# Altium schematic sheet GeneralScheme.SchDoc: Машинка на радиоуправлении
size 420 x 297 mm; Author: Веричев Е. О.; SheetNumber: 1; SheetTotal: 1
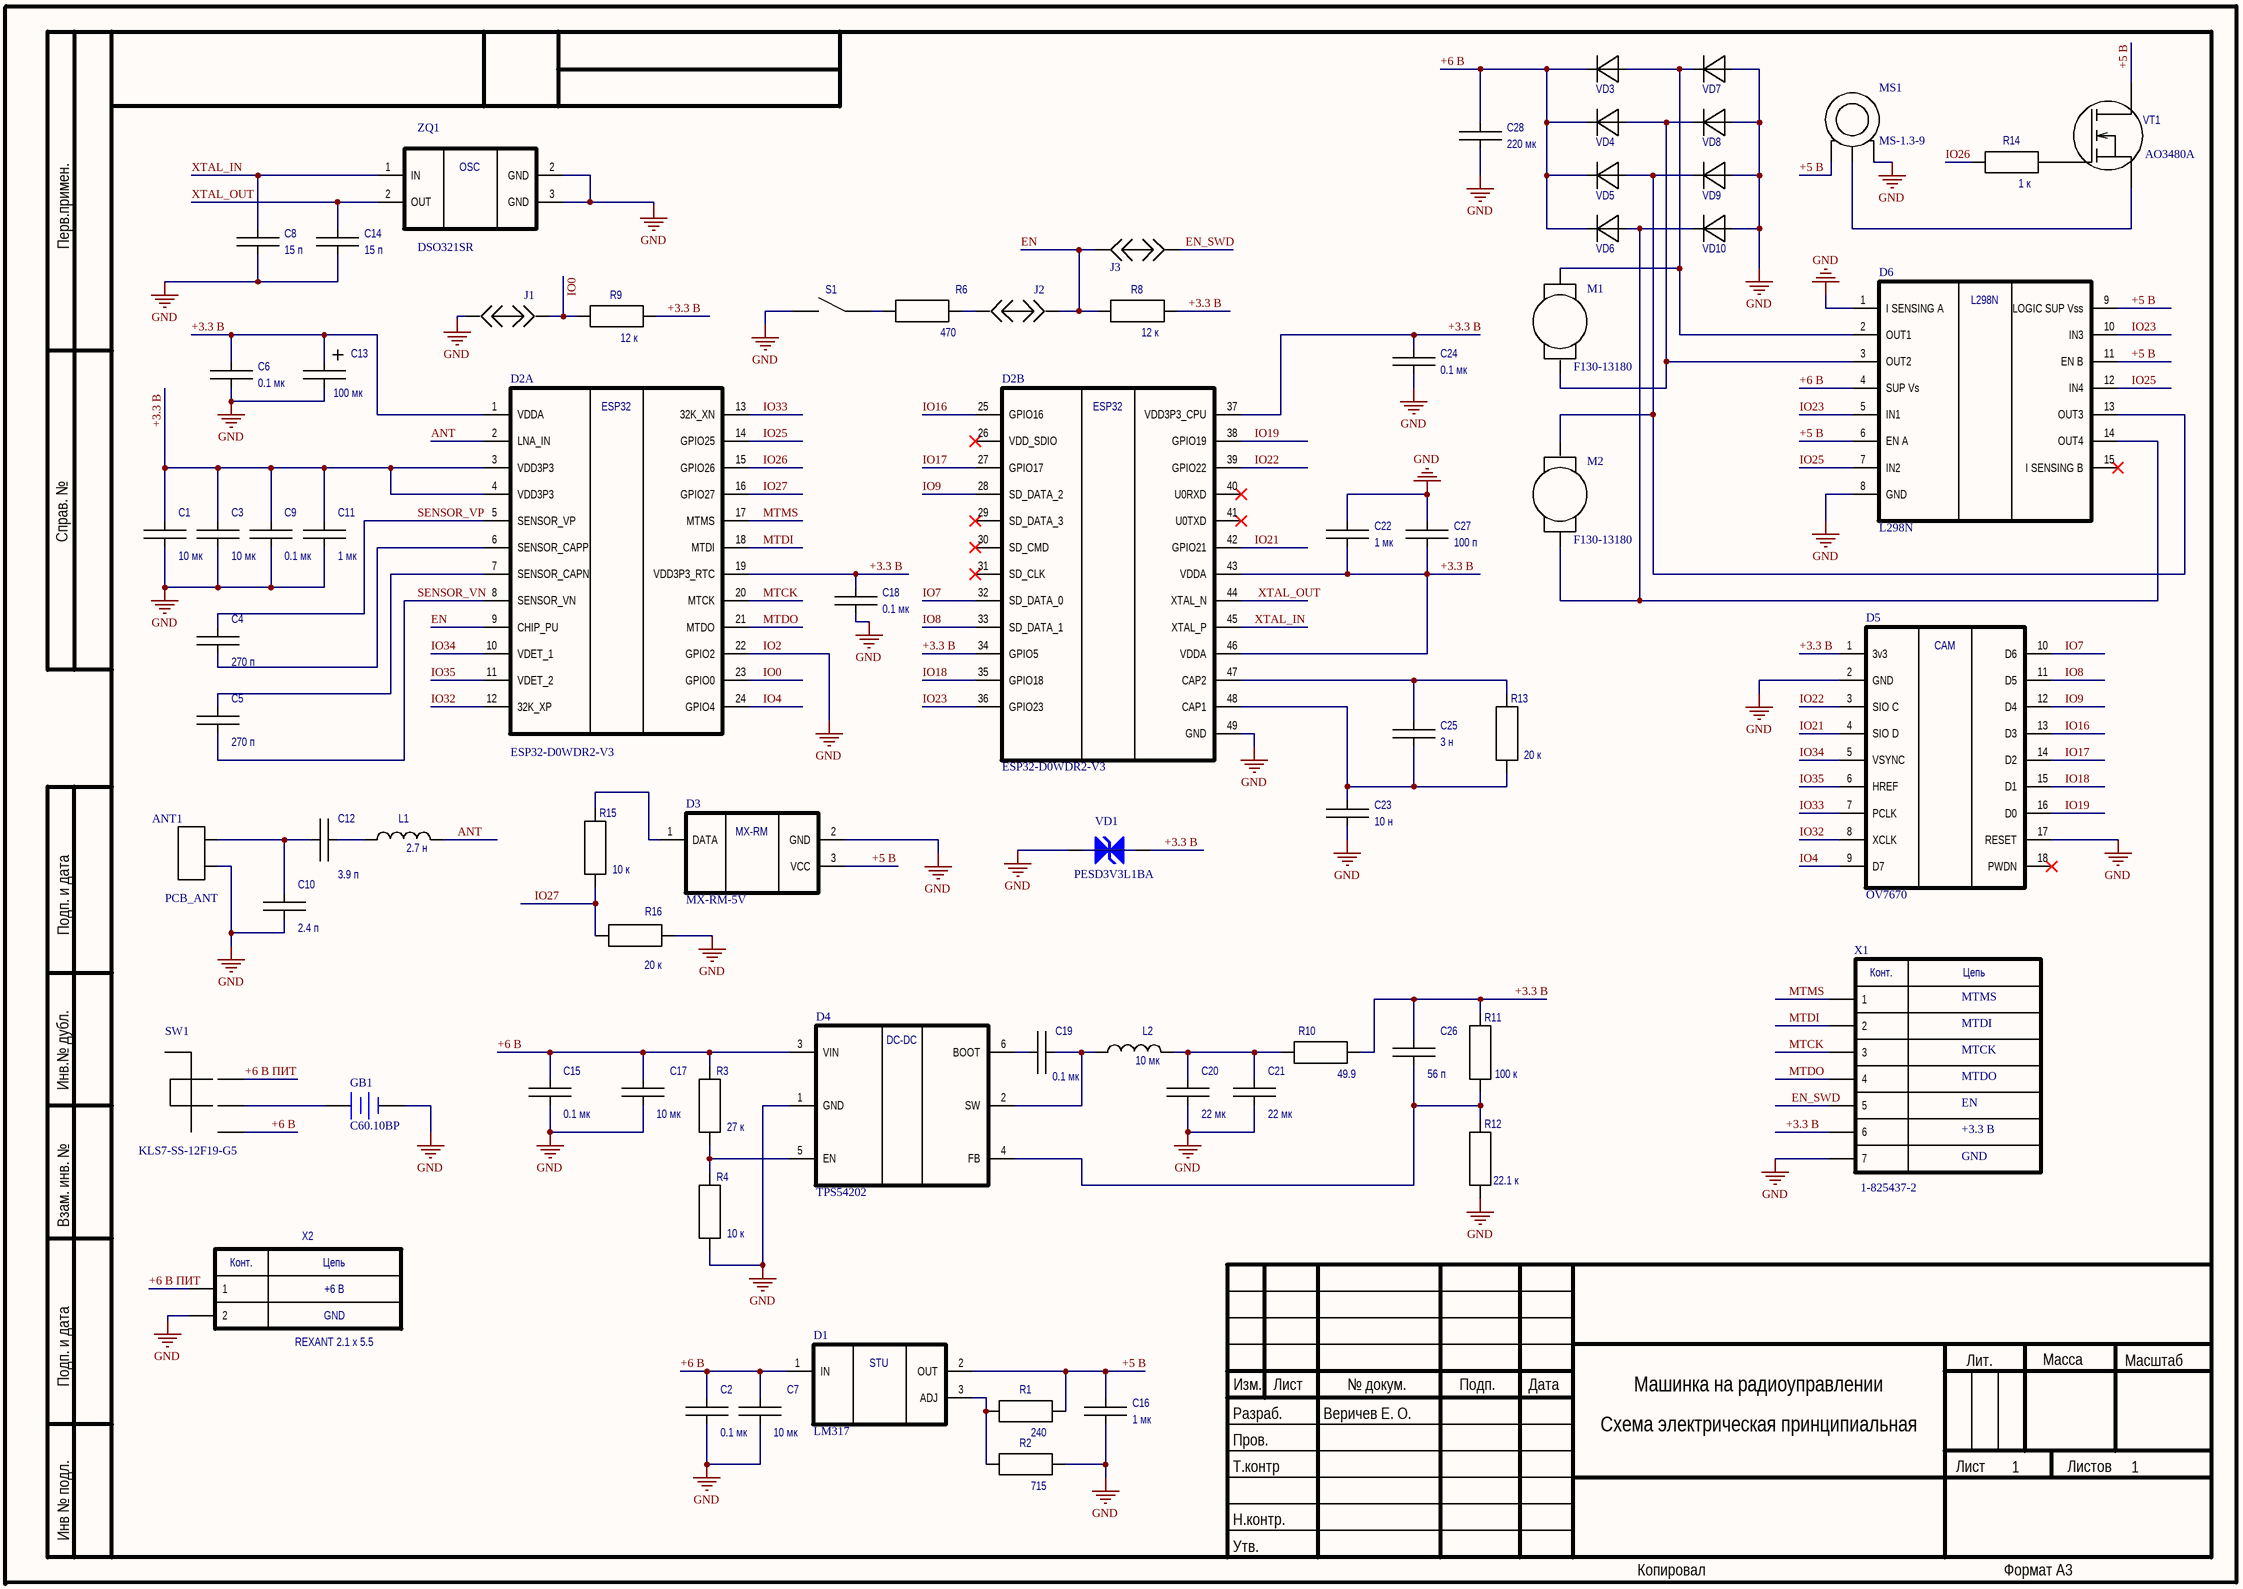
[diagram p0: GeneralScheme.SchDoc]

## Parts
ANT1  PCB_ANT
C1  value 10 мк  (hidden comment: 10 мкФ ±* * * *, *)
C2  value 0.1 мк  (hidden comment: 0.1 мкФ ±* * * *, *)
C3  value 10 мк  (hidden comment: 10 мкФ ±* * * *, *)
C4  value 270 п  (hidden comment: 270 пФ ±* * * *, *)
C5  value 270 п  (hidden comment: 270 пФ ±* * * *, *)
C6  value 0.1 мк  (hidden comment: 0.1 мкФ ±* * * *, *)
C7  value 10 мк  (hidden comment: 10 мкФ ±* * * *, *)
C8  value 15 п  (hidden comment: 15 пФ ±* * * *, *)
C9  value 0.1 мк  (hidden comment: 0.1 мкФ ±* * * *, *)
C10  value 2.4 п  (hidden comment: 2.4 пФ ±* * * *, *)
C11  value 1 мк  (hidden comment: 1 мкФ ±* * * *, *)
C12  value 3.9 п  (hidden comment: 3.9 пФ ±* * * *, *)
C13  value 100 мк  (hidden comment: 100 мкФ ±* * * *, *)
C14  value 15 п  (hidden comment: 15 пФ ±* * * *, *)
C15  value 0.1 мк  (hidden comment: 0.1 мкФ ±* * * *, *)
C16  value 1 мк  (hidden comment: 1 мкФ ±* * * *, *)
C17  value 10 мк  (hidden comment: 10 мкФ ±* * * *, *)
C18  value 0.1 мк  (hidden comment: 0.1 мкФ ±* * * *, *)
C19  value 0.1 мк  (hidden comment: 0.1 мкФ ±* * * *, *)
C20  value 22 мк  (hidden comment: 22 мкФ ±* * * *, *)
C21  value 22 мк  (hidden comment: 22 мкФ ±* * * *, *)
C22  value 1 мк  (hidden comment: 1 мкФ ±* * * *, *)
C23  value 10 н  (hidden comment: 10 нФ ±* * * *, *)
C24  value 0.1 мк  (hidden comment: 0.1 мкФ ±* * * *, *)
C25  value 3 н  (hidden comment: 3 нФ ±* * * *, *)
C26  value 56 п  (hidden comment: 56 пФ ±* * * *, *)
C27  value 100 п  (hidden comment: 100 пФ ±* * * *, *)
C28  value 220 мк  (hidden comment: 220 мкФ ±* * * *, *)
D1  LM317
D2  ESP32-D0WDR2-V3  (parts A,B of 2)
D3  MX-RM-5V
D4  TPS54202
D5  OV7670
D6  L298N
GB1  C60.10BP  [BAT-2]
J1  Jumper  (value not drawn)
J2  Jumper  (value not drawn)
J3  Jumper  (value not drawn)
L1  2.7 н
L2  10 мк
M1  F130-13180
M2  F130-13180
MS1  MS-1.3-9
R1  value 240
R2  value 715
R3  value 27 к
R4  value 10 к
R6  value 470
R8  value 12 к
R9  value 12 к
R10  value 49.9
R11  value 100 к
R12  value 22.1 к
R13  value 20 к
R14  value 1 к
R15  value 10 к
R16  value 20 к
S1  Тактильный переключатель KLS7-TS6604-4.3-180-B KLS  (value not drawn)
SW1  KLS7-SS-12F19-G5
VD1  PESD3V3L1BA  [DIODE-0.7]
VD2  D Zener  [DIODE-0.7]  (value not drawn)
VD3  MBR0540  (value not drawn)
VD4  MBR0540  (value not drawn)
VD5  MBR0540  (value not drawn)
VD6  MBR0540  (value not drawn)
VD7  MBR0540  (value not drawn)
VD8  MBR0540  (value not drawn)
VD9  MBR0540  (value not drawn)
VD10  MBR0540  (value not drawn)
VT1  AO3480A
X1  1-825437-2  Parameter 7: GND  Parameter 6: +3.3 В  Parameter 2: MTDI  Parameter 5: EN  Parameter 4: MTDO  Parameter 3: MTCK  Parameter 1: MTMS
X2  REXANT 2.1 х 5.5  1: +6 В  2: GND
ZQ1  DSO321SR

## Nets
IO2: ANT1.2 C1.1 C2.1 C3.1 C6.1 C7.1 C8.1 C9.1 C10.1 C11.1 C13.2 C14.1 C15.1 C16.1 C17.1 C18.1 C20.1 C21.1 C22.2 C23.1 C24.1 C27.2 C28.1 D2.22(GPIO2) D2.49(GND) D3.2(GND) D4.1(GND) D5.2(GND) D5.17(RESET) D6.1(I_SENSING_A) D6.8(GND) GB1.2(-) J1.1 MS1.2(GND) R2.1 R4.1 R12.1 R16.1 S1.4 VD1.1(A) VD7.1(A) VD8.1(A) VD9.1(A) VD10.1(A) X1.7 X2.2 ZQ1.2(GND) ZQ1.3(GND)  [also labelled GND]
+3.3 В: C1.2 C3.2 C6.2 C9.2 C11.2 C13.1 C18.2 C22.1 C24.2 C26.2 C27.1 D2.1(VDDA) D2.3(VDD3P3) D2.4(VDD3P3) D2.19(VDD3P3_RTC) D2.34(GPIO5) D2.37(VDD3P3_CPU) D2.43(VDDA) D2.46(VDDA) D5.1(3v3) R8.2 R9.2 R10.1 R11.2 VD2.1(A) X1.6
+5 В: C16.2 D1.2(OUT) D3.3(VCC) D6.6(EN_A) D6.9(LOGIC_SUP_Vss) D6.11(EN_B) MS1.1(VDD) R1.1 VT1.1
+6 В: C2.2 C7.2 C15.2 C17.2 C28.2 D1.1(IN) D4.3(VIN) D6.4(SUP_Vs) R3.2 SW1.3 VD3.1(C) VD4.1(C) VD5.1(C) VD6.1(C)
+6 В ПИТ: SW1.1 X2.1
ANT: D2.2(LNA_IN) L1.1
EN: D2.9(CHIP_PU) J2.2 J3.2 R8.1
EN_SWD: J3.1 X1.5
IO0: D2.23(GPIO0) J1.2 R9.1
IO4: D2.24(GPIO4) D5.9(D7)
IO7: D2.32(SD_DATA_0) D5.10(D6)
IO8: D2.33(SD_DATA_1) D5.11(D5)
IO9: D2.28(SD_DATA_2) D5.12(D4)
IO16: D2.25(GPIO16) D5.13(D3)
IO17: D2.27(GPIO17) D5.14(D2)
IO18: D2.35(GPIO18) D5.15(D1)
IO19: D2.38(GPIO19) D5.16(D0)
IO21: D2.42(GPIO21) D5.4(SIO_D)
IO22: D2.39(GPIO22) D5.3(SIO_C)
IO23: D2.36(GPIO23) D6.5(IN1) D6.10(IN3)
IO25: D2.14(GPIO25) D6.7(IN2) D6.12(IN4)
IO26: D2.15(GPIO26) R14.1
IO27: D2.16(GPIO27) R15.1 R16.2
IO32: D2.12(32K_XP) D5.8(XCLK)
IO33: D2.13(32K_XN) D5.7(PCLK)
IO34: D2.10(VDET_1) D5.5(VSYNC)
IO35: D2.11(VDET_2) D5.6(HREF)
MTCK: D2.20(MTCK) X1.3
MTDI: D2.18(MTDI) X1.2
MTDO: D2.21(MTDO) X1.4
MTMS: D2.17(MTMS) X1.1
SENSOR_VN: C5.1 D2.8(SENSOR_VN)
SENSOR_VP: C4.2 D2.5(SENSOR_VP)
XTAL_IN: C8.2 D2.45(XTAL_P) ZQ1.1(IN)
XTAL_OUT: C14.2 D2.44(XTAL_N) ZQ1.2(OUT)
NetANT1_1: ANT1.1 C10.2 C12.2
NetC4_1: C4.1 D2.6(SENSOR_CAPP)
NetC5_2: C5.2 D2.7(SENSOR_CAPN)
NetC12_1: C12.1 L1.2
NetC19_1: C19.1 D4.2(SW) L2.2
NetC19_2: C19.2 D4.6(BOOT)
NetC20_2: C20.2 C21.2 L2.1 R10.2
NetC23_2: C23.2 C25.1 D2.48(CAP1) R13.1
NetC25_2: C25.2 D2.47(CAP2) R13.2
NetC26_1: C26.1 D4.4(FB) R11.1 R12.2
NetD1_3: D1.3(ADJ) R1.2 R2.2
NetD3_1: D3.1(DATA) R15.2
NetD4_5: D4.5(EN) R3.1 R4.2
NetD6_2: D6.2(OUT1) M1.1 VD3.1(A) VD7.1(C)
NetD6_3: D6.3(OUT2) M1.2 VD4.1(A) VD8.1(C)
NetD6_13: D6.13(OUT3) M2.1 VD5.1(A) VD9.1(C)
NetD6_14: D6.14(OUT4) M2.2 VD6.1(A) VD10.1(C)
NetGB1_1: GB1.1(+) SW1.2
NetJ2_1: J2.1 R6.2
NetMS1_2: MS1.2(CNTRL) VT1.2
NetR6_1: R6.1 S1.2
NetR14_2: R14.2 VT1.3
NetVD1_2: VD1.2(K) VD2.2(K)

Not connected (* = marked no-connect by the designer): D2 26(VDD_SDIO)* 29(SD_DATA_3)* 30(SD_CMD)* 31(SD_CLK)* 40(U0RXD)* 41(U0TXD)*; D5 18(PWDN)*; D6 15(I_SENSING_B)*; SW1 01

## Notes on the sheet
- Перв.примен.
- Справ. №
- Подп. и дата
- Инв.№ дубл.
- Взам. инв. №
- Изм.
- Лист
- № докум.
- Подп.
- Дата
- Лит.
- Масса
- Масштаб
- Пров.
- Т.контр
- Разраб.
- Схема электрическая принципиальная
- 1
- Листов
- Инв № подл.
- Н.контр.
- Утв.
- Копировал
- Формат А3
- (in symbol DSO321SR_oscill) OSC
- (in symbol ESP32-D0WDR2-V3, part A) ESP32
- (in symbol ESP32-D0WDR2-V3, part B) ESP32
- (in symbol LM317) STU
- (in symbol MX-RM-5V_reciever_module) MX-RM
- (in symbol OV7670_module) CAM
- (in symbol TPS54202_DCDC) DC-DC
- (in symbol X - Контактное поле х2) Конт.; Цепь
- (in symbol X - контактное поле х7) Конт.; Цепь

## Library data of the parts
C1-C12 C14-C28 = C - Конденсатор: Company: *; PartNumber: *; Tolerance: *; Voltage: *; Type: *; Package: *
C13 = C+ - Конденсатор электролитический: Company: *; Tolerance: *; Voltage: *; Type: *; PartNumber: *; Package: *
D3 = MX-RM-5V_reciever_module
D4 = TPS54202_DCDC
D5 = OV7670_module
GB1 = Battery: Multicell Battery; Published: 24-Mar-1999; LatestRevisionDate: 17-Jul-2002; LatestRevisionNote: Re-released for DXP Platform.; PackageReference: BAT-2; Publisher: Altium Limited; PackageDescription: Battery; 2 Leads
L1 L2 = L - induct_my
R1-R4 R6 R8-R16 = R - Резистор: Company: *; PartNumber: *; Package: *; Tolerance: *
S1 = S - Кнопка тактовая: Company: KLS; PartNumber: KLS7-TS6604-4.3-180-B
SW1 = Switch
VD1 VD2 = D Zener: Zener Diode; Published: 8-Jun-2000; LatestRevisionDate: 17-Jul-2002; LatestRevisionNote: Re-released for DXP Platform.; PackageReference: DIODE-0.7; Publisher: Altium Limited; PackageDescription: Diode, Thru-Hole; 2 Leads; 0.7 in Pin Spacing
VD3-VD10 = VD - Диод обычный: Company: International Rectifier; PartNumber: MBR0540; Package: SOD-123; Value: MBR0540
VT1 = VT - Полевой транзистор N канал (MOSFET_N): VT
X1 = X - контактное поле х7
X2 = X - Контактное поле х2
ZQ1 = DSO321SR_oscill